# EAGLE design M111A (EAGLE 6.6.0)
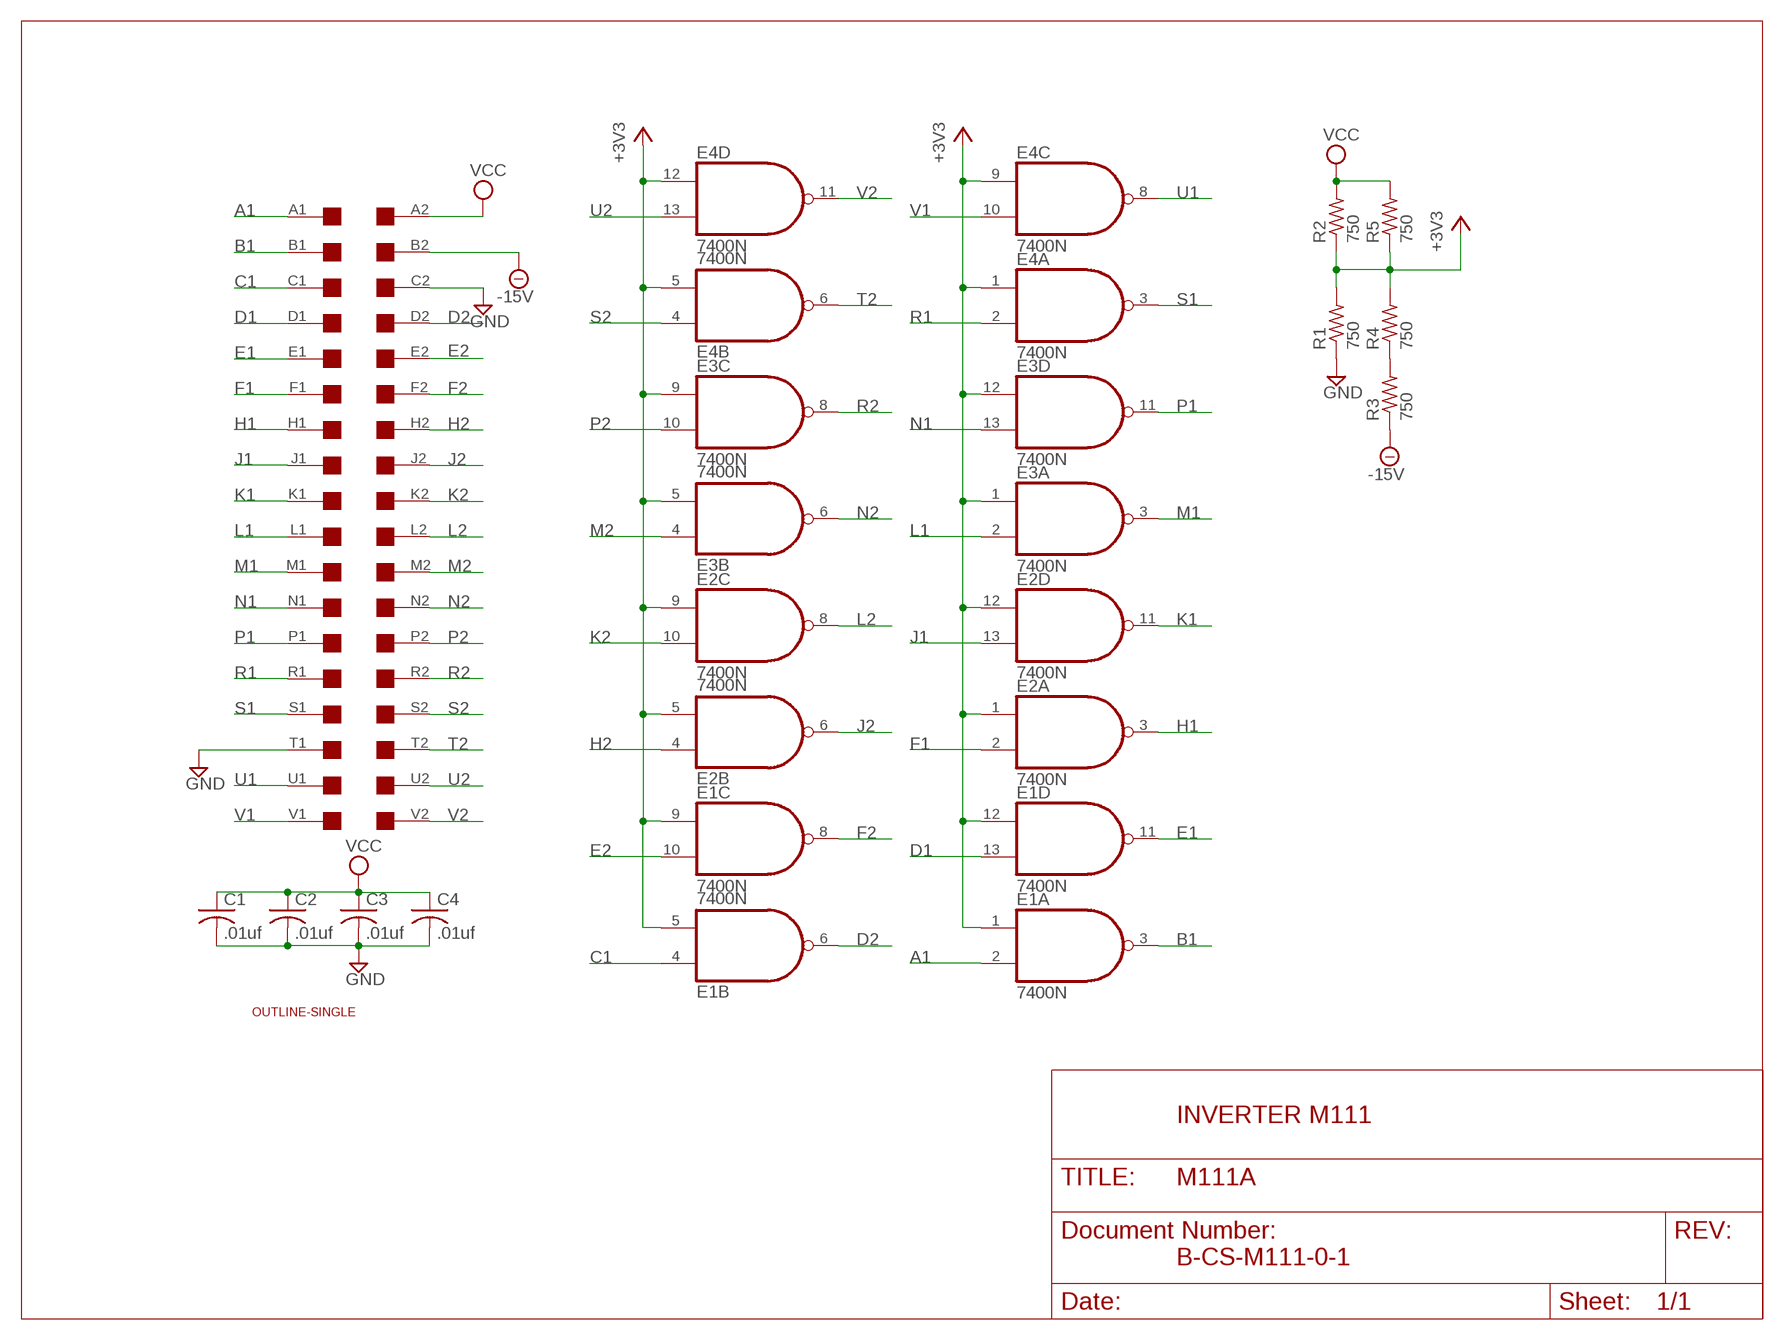
[diagram p0: schematic, sheet 1]

## Parts
A  EDGE-2CONNECTOR  [EDGE-CON2]
C1  .01uf  C-US050-025X075  [C050-025X075]
C2  .01uf  C-US050-025X075  [C050-025X075]
C3  .01uf  C-US050-025X075  [C050-025X075]
C4  .01uf  C-US050-025X075  [C050-025X075]
E1  7400N  [DIL14]
E2  7400N  [DIL14]
E3  7400N  [DIL14]
E4  7400N  [DIL14]
R1  750  R-US_0207/10  [0207/10]
R2  750  R-US_0207/10  [0207/10]
R3  750  R-US_0207/10  [0207/10]
R4  750  R-US_0207/10  [0207/10]
R5  750  R-US_0207/10  [0207/10]
U$1  OUTLINE-SINGLE  [SINGLE]

## Nets
+3V3: E1.1(A:I0) E1.5(B:I1) E1.9(C:I0) E1.12(D:I0) E2.1(A:I0) E2.5(B:I1) E2.9(C:I0) E2.12(D:I0) E3.1(A:I0) E3.5(B:I1) E3.9(C:I0) E3.12(D:I0) E4.1(A:I0) E4.5(B:I1) E4.9(C:I0) E4.12(D:I0) R1.2 R2.1 R4.2 R5.1
-15V: A.B2 R3.1
A1: A.A1 E1.2(A:I1)
B1: A.B1 E1.3(A:O)
C1: A.C1 E1.4(B:I0)
D1: A.D1 E1.13(D:I1)
D2: A.D2 E1.6(B:O)
E1: A.E1 E1.11(D:O)
E2: A.E2 E1.10(C:I1)
F1: A.F1 E2.2(A:I1)
F2: A.F2 E1.8(C:O)
GND [Supply]: A.C2 A.T1 C1.2 C2.2 C3.2 C4.2 R1.1
H1: A.H1 E2.3(A:O)
H2: A.H2 E2.4(B:I0)
J1: A.J1 E2.13(D:I1)
J2: A.J2 E2.6(B:O)
K1: A.K1 E2.11(D:O)
K2: A.K2 E2.10(C:I1)
L1: A.L1 E3.2(A:I1)
L2: A.L2 E2.8(C:O)
M1: A.M1 E3.3(A:O)
M2: A.M2 E3.4(B:I0)
N1: A.N1 E3.13(D:I1)
N2: A.N2 E3.6(B:O)
N$1: R3.2 R4.1
P1: A.P1 E3.11(D:O)
P2: A.P2 E3.10(C:I1)
R1: A.R1 E4.2(A:I1)
R2: A.R2 E3.8(C:O)
S1: A.S1 E4.3(A:O)
S2: A.S2 E4.4(B:I0)
T2: A.T2 E4.6(B:O)
U1: A.U1 E4.8(C:O)
U2: A.U2 E4.13(D:I1)
V1: A.V1 E4.10(C:I1)
V2: A.V2 E4.11(D:O)
VCC [Supply]: A.A2 C1.1 C2.1 C3.1 C4.1 R2.2 R5.2

## Notes on the sheet
- INVERTER M111
- B-CS-M111-0-1

## Power pins joined to a net without a drawn wire
GND: E1.7(P:GND) E2.7(P:GND) E3.7(P:GND) E4.7(P:GND)
VCC: E1.14(P:VCC) E2.14(P:VCC) E3.14(P:VCC) E4.14(P:VCC)

## Library data of the parts
A = dec-con:EDGE-2: Double-Sided DEC edge connector.
C1-C4 = rcl:C-US: CAPACITOR, American symbol
E1-E4 = 74xx-us:74*00: Quad 2-input NAND gate
R1-R5 = rcl:R-US_: RESISTOR, American symbol
U$1 = dec-con:OUTLINE-*: Board outlines for DEC boards.

## Net classes
1 Supply: width 0.813 mm

## Board
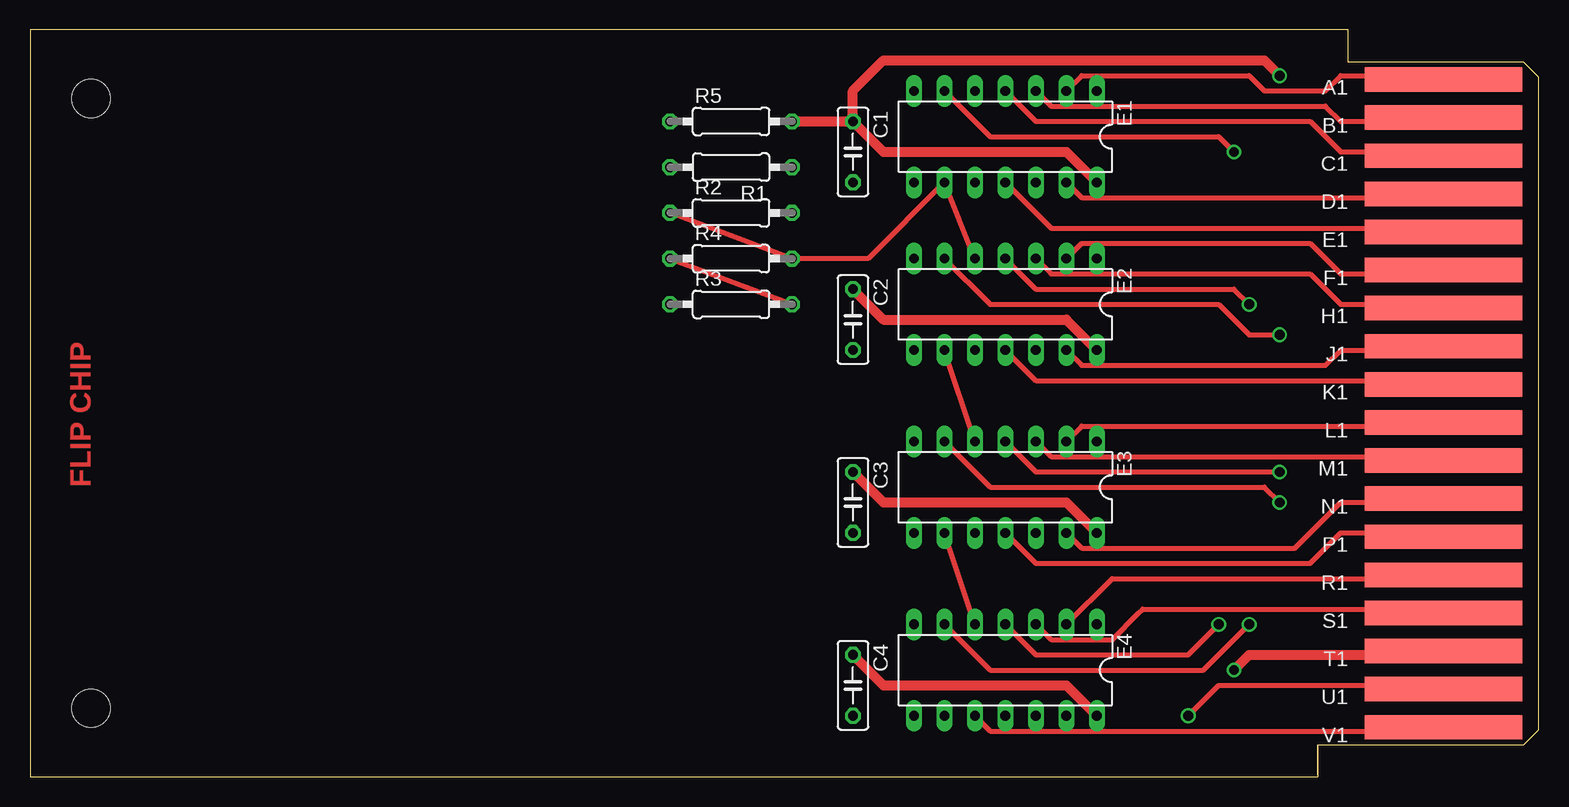
[diagram p1: board, top side]
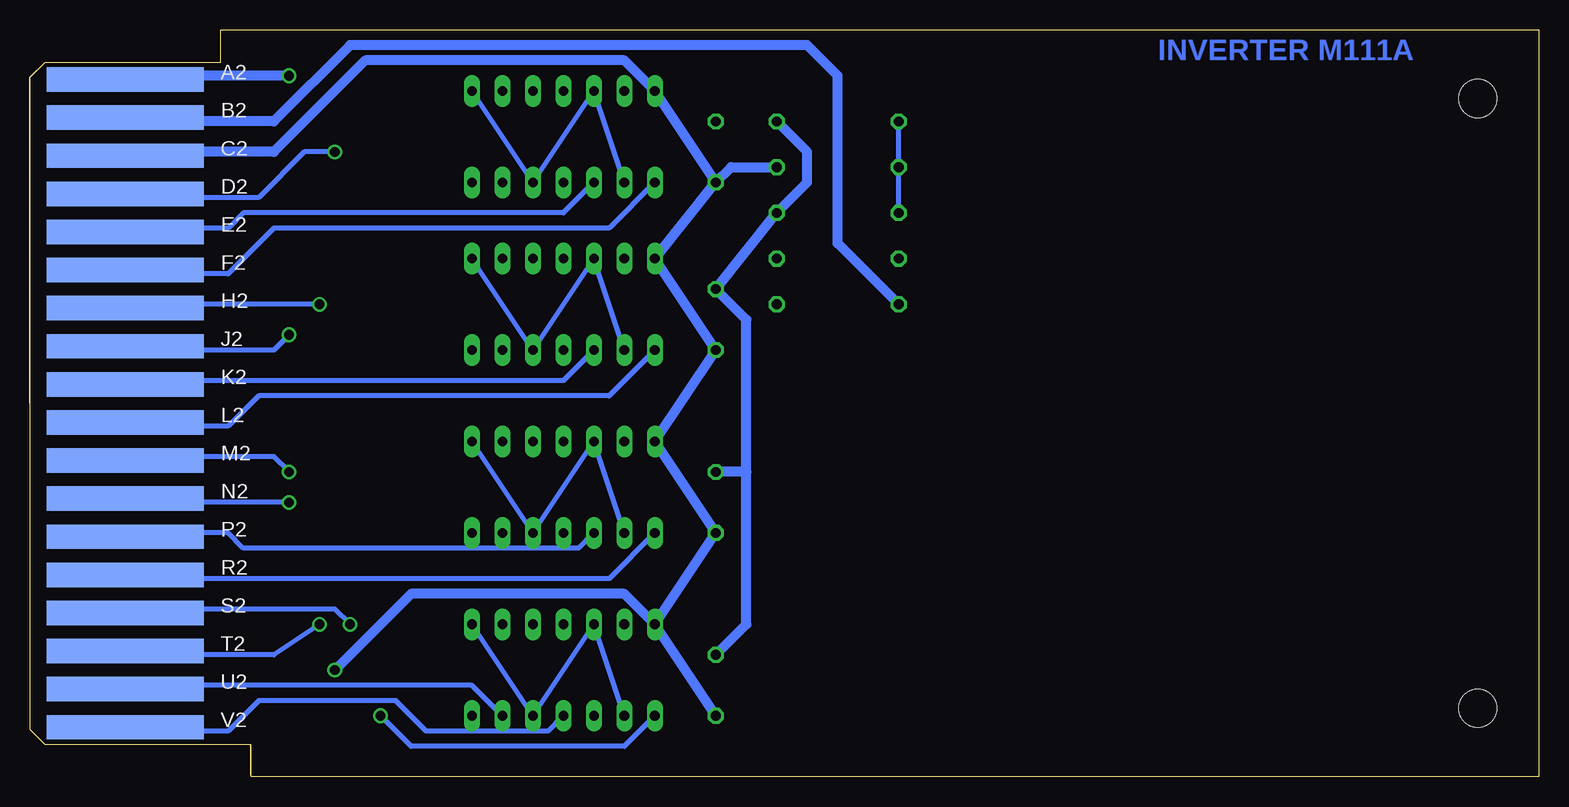
[diagram p2: board, bottom side, seen from below]

Size 125.73 x 62.23 mm. Coordinates in mm from the lower left corner, seen from the top.
Copper layers (1+16): Top 0.035mm / dielectric 1.5mm / Bottom 0.035mm
Design rules "16mils": minimum track width 16mil, minimum drill 32mil, track to track 15mil, track to pad 10mil, pad to pad 10mil, via to via 10mil, smd to smd 10mil, copper to edge 13mil, drill to drill 10mil, minimum pad ring 10mil, minimum via ring 8mil, stop-mask expansion 0mil, vias tented up to drill 0mil, thermal gap 10mil

### Footprints (pad centres in the part's own frame; a part is rotated, then mirrored left to right if it is on the bottom)
EDGE-CON2 = smd 13.106 x 2.032: A1 7.938,4.128; B1 7.938,7.303; C1 7.938,10.477; D1 7.938,13.652; E1 7.938,16.828; F1 7.938,20.003; H1 7.938,23.177; J1 7.938,26.352; K1 7.938,29.527; L1 7.938,32.703; M1 7.938,35.877; N1 7.938,39.053; P1 7.938,42.227; R1 7.938,45.403; S1 7.938,48.578; T1 7.938,51.752; U1 7.938,54.928; V1 7.938,58.102 | smd 13.106 x 2.032 bottom: A2 7.938,4.128; B2 7.938,7.303; C2 7.938,10.477; D2 7.938,13.652; E2 7.938,16.828; F2 7.938,20.003; H2 7.938,23.177; J2 7.938,26.352; K2 7.938,29.527; L2 7.938,32.703; M2 7.938,35.877; N2 7.938,39.053; P2 7.938,42.227; R2 7.938,45.403; S2 7.938,48.578; T2 7.938,51.752; U2 7.938,54.928; V2 7.938,58.102
C050-025X075 = drill 0.813 octagon: 1 -2.54,0; 2 2.54,0
DIL14 = drill 0.813 long: 1 -7.62,-3.81; 2 -5.08,-3.81; 3 -2.54,-3.81; 4 0,-3.81; 5 2.54,-3.81; 6 5.08,-3.81; 7 7.62,-3.81; 8 7.62,3.81; 9 5.08,3.81; 10 2.54,3.81; 11 0,3.81; 12 -2.54,3.81; 13 -5.08,3.81; 14 -7.62,3.81
0207/10 = drill 0.813 octagon: 1 -5.08,0; 2 5.08,0
SINGLE = hole 3.175: 120.65,56.515; 120.65,5.715

### Placement (x,y rotation side)
A  125.73,62.23 180 top
C1  68.58,52.07 270 top
C2  68.58,38.1 270 top
C3  68.58,22.86 270 top
C4  68.58,7.62 270 top
E1  81.28,53.34 180 top
E2  81.28,39.37 180 top
E3  81.28,24.13 180 top
E4  81.28,8.89 180 top
R1  58.42,50.8 180 top
R2  58.42,46.99 0 top
R3  58.42,39.37 0 top
R4  58.42,43.18 0 top
R5  58.42,54.61 0 top
U$1  125.73,62.23 180 top

### Tracks (layer width: path | path; a pad name or v marks a point on that pad's centre or on a via)
+3V3
  Top 0.406: R2.1 R4.2 69.85,43.18 E1.9 E2.5 | E4.5 E3.9 | E3.5 E2.9
  Bottom 0.406: R2.1 R1.2 R5.1 | E1.1 E1.12 E1.5 E1.9 | E2.9 E2.5 E2.12 E2.1 | E4.1 E4.12 E4.5 E4.9 | E3.1 E3.12 E3.5 E3.9
-15V
  Bottom 0.813: A.B2 112.05,54.9 111.76,54.61 105.41,54.61 99.06,60.96 60.96,60.96 58.42,58.42 58.42,44.45 R3.1
A1
  Top 0.406: A.A1 117.7,58.42 109.22,58.42 107.95,57.15 102.87,57.15 101.6,58.42 87.63,58.42 E1.2
B1
  Top 0.406: A.B1 112.05,54.9 111.76,54.61 109.22,54.61 107.95,55.88 85.09,55.88 E1.3
C1
  Top 0.406: A.C1 112.09,51.74 111.76,52.07 109.22,52.07 106.68,54.61 83.82,54.61 E1.4
D1
  Top 0.406: E1.13 87.63,48.26 111.76,48.26 112.06,48.56 A.D1
D2  (via drill 0.81)
  Top 0.406: E1.6 80.01,53.34 99.06,53.34 v100.33,52.07
  Bottom 0.406: v100.33,52.07 102.87,52.07 106.68,48.26 111.76,48.26 112.06,48.56 A.D2
E1
  Top 0.406: A.E1 112.09,45.39 111.76,45.72 85.09,45.72 E1.11
E2
  Bottom 0.406: A.E2 112.09,45.39 111.76,45.72 109.22,45.72 107.95,46.99 81.28,46.99 E1.10
F1
  Top 0.406: A.F1 112.04,42.19 111.76,41.91 109.22,41.91 106.68,44.45 87.63,44.45 E2.2
F2
  Bottom 0.406: A.F2 112.04,42.19 111.76,41.91 109.22,41.91 105.41,45.72 77.47,45.72 E1.8
GND  (via drill 0.81)
  Top 0.813: A.T1 112.09,10.49 111.76,10.16 101.6,10.16 v100.33,8.89
  Bottom 0.813: C1.2 E1.7 76.2,59.69 97.79,59.69 105.41,52.07 111.76,52.07 112.09,51.74 A.C2 | C4.2 E4.7 | E4.7 C3.2 E3.7 C2.2 E2.7 C1.2 | R1.1 67.31,50.8 C1.2 | v100.33,8.89 93.98,15.24 76.2,15.24 E4.7
H1
  Top 0.406: A.H1 112.09,39.04 111.76,39.37 109.22,39.37 106.68,41.91 85.09,41.91 E2.3
H2  (via drill 0.81)
  Top 0.406: v101.6,39.37 100.33,40.64 83.82,40.64 E2.4
  Bottom 0.406: A.H2 112.09,39.04 111.76,39.37 v101.6,39.37
J1
  Top 0.406: A.J1 112.09,35.89 111.76,35.56 109.22,35.56 107.95,34.29 87.63,34.29 E2.13
J2  (via drill 0.81)
  Top 0.406: v104.14,36.83 101.6,36.83 99.06,39.37 80.01,39.37 E2.6
  Bottom 0.406: A.J2 112.09,35.89 111.76,35.56 105.41,35.56 v104.14,36.83
K1
  Top 0.406: A.K1 112.06,32.72 111.76,33.02 83.82,33.02 E2.11
K2
  Bottom 0.406: A.K2 112.06,32.72 111.76,33.02 81.28,33.02 E2.10
L1
  Top 0.406: A.L1 112.09,29.54 111.76,29.21 87.63,29.21 E3.2
L2
  Bottom 0.406: A.L2 112.09,29.54 111.76,29.21 109.22,29.21 106.68,31.75 77.47,31.75 E2.8
M1
  Top 0.406: A.M1 112.09,26.34 111.76,26.67 85.09,26.67 E3.3
M2  (via drill 0.81)
  Top 0.406: v104.14,25.4 83.82,25.4 E3.4
  Bottom 0.406: A.M2 112.09,26.34 111.76,26.67 105.41,26.67 v104.14,25.4
N1
  Top 0.406: A.N1 112.09,23.19 111.76,22.86 109.22,22.86 105.41,19.05 87.63,19.05 E3.13
N2  (via drill 0.81)
  Top 0.406: v104.14,22.86 102.87,24.13 80.01,24.13 E3.6
  Bottom 0.406: A.N2 112.09,23.19 111.76,22.86 v104.14,22.86
N$1
  Top 0.406: R4.1 R3.2
P1
  Top 0.406: A.P1 112.09,19.99 111.76,20.32 109.22,20.32 106.68,17.78 83.82,17.78 E3.11
P2
  Bottom 0.406: A.P2 112.09,19.99 111.76,20.32 109.22,20.32 107.95,19.05 80.01,19.05 E3.10
R1
  Top 0.406: A.R1 112.09,16.84 111.76,16.51 90.17,16.51 E4.2
R2
  Bottom 0.406: A.R2 112.09,16.84 111.76,16.51 77.47,16.51 E3.8
S1
  Top 0.406: A.S1 112.06,13.66 111.76,13.97 92.71,13.97 92.41,13.66 90.17,11.43 85.09,11.43 E4.3
S2  (via drill 0.81)
  Top 0.406: v99.06,12.7 96.52,10.16 83.82,10.16 E4.4
  Bottom 0.406: A.S2 112.06,13.66 111.76,13.97 100.33,13.97 v99.06,12.7
T2  (via drill 0.81)
  Top 0.406: v101.6,12.7 97.79,8.89 80.01,8.89 E4.6
  Bottom 0.406: A.T2 112.09,10.49 111.76,10.16 105.41,10.16 v101.6,12.7
U1  (via drill 0.81)
  Top 0.406: A.U1 112.12,7.26 111.76,7.62 99.06,7.62 v96.52,5.08
  Bottom 0.406: E4.8 76.2,2.54 93.98,2.54 v96.52,5.08
U2
  Bottom 0.406: A.U2 112.12,7.26 111.76,7.62 88.9,7.62 E4.13
V1
  Top 0.406: A.V1 112.15,4.2 111.76,3.81 80.01,3.81 E4.10
V2
  Bottom 0.406: A.V2 112.15,4.2 111.76,3.81 109.22,3.81 106.68,6.35 95.25,6.35 92.71,3.81 82.55,3.81 E4.11
VCC  (via drill 0.81)
  Top 0.813: E4.14 86.36,7.62 71.12,7.62 C4.1 | E3.14 86.36,22.86 71.12,22.86 C3.1 | E2.14 86.36,38.1 71.12,38.1 C2.1 | E1.14 86.36,52.07 71.12,52.07 C1.1 | v104.14,58.42 102.87,59.69 71.12,59.69 68.58,57.15 C1.1 | R5.2 C1.1
  Bottom 0.813: A.A2 112.16,58.02 111.76,58.42 v104.14,58.42 | R5.2 60.96,52.07 60.96,49.53 R2.2 C2.1 66.04,38.1 66.04,25.4 | C4.1 66.04,12.7 66.04,25.4 | 66.04,25.4 C3.1

### Text on the board
Top: FLIP CHIP
Bottom: INVERTER M111A